# EAGLE design VentMonSwitches (EAGLE 9.6.2)
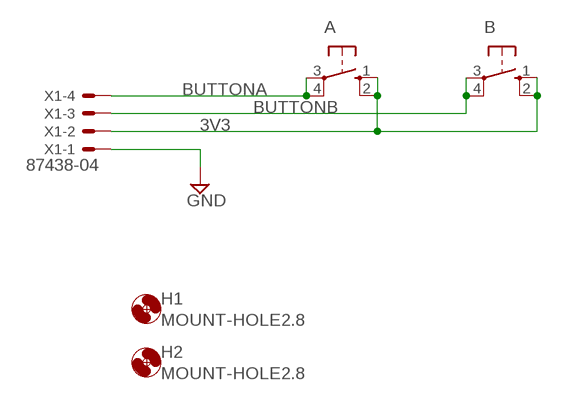
[diagram p0: schematic, sheet 1]

## Parts
A  10-XX  [B3F-10XX]
B  10-XX  [B3F-10XX]
H1  MOUNT-HOLE2.8  [2,8]
H2  MOUNT-HOLE2.8  [2,8]
X1  87438-04  [87438-04]

## Nets
3V3: A.1(S) A.2(S1) B.1(S) B.2(S1) X1.2
BUTTONA: A.3(P) A.4(P1) X1.4
BUTTONB: B.3(P) B.4(P1) X1.3
GND: X1.1

## Library data of the parts
A B = switch-omron:10-XX: OMRON SWITCH; MPN: B3F-1000; OC_FARNELL: 176432; OC_NEWARK: 36M3542
H1 H2 = holes:MOUNT-HOLE: MOUNTING HOLE with drill center marker
X1 = con-molex:87438-04: Wire-to-Board 1.50mm (.059") Pitch Header - Right Angle, SMT, Shrouded Source: http://www.molex.com/product/micro/87438.html; MF: MOLEX; OC_FARNELL: unknown; OC_NEWARK: unknown

## Board
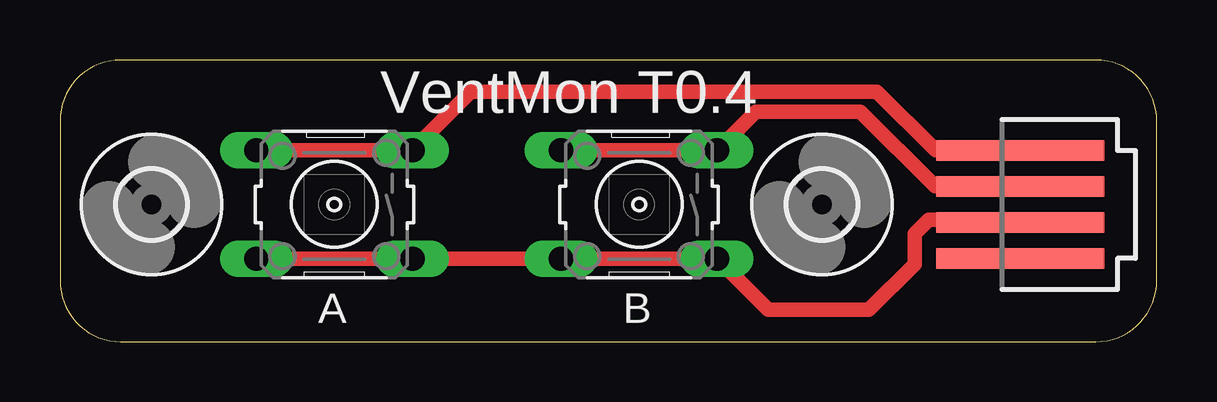
[diagram p1: board, top side]

Size 45.7 x 11.73 mm. Coordinates in mm from the lower left corner, seen from the top.
Outline: 43.16,11.73 2.54,11.73 arc90 0,9.2 0,2.54 arc90 2.54,0 43.16,0 arc90 45.7,2.54 45.7,9.2 arc90 43.16,11.73
Copper layers (1*16): Top 0.035mm / dielectric 1.5mm / Bottom 0.035mm
Design rules "default": minimum track width 6mil, minimum drill 0.35mm, track to track 6mil, track to pad 6mil, pad to pad 6mil, via to via 6mil, smd to smd 6mil, copper to edge 40mil, drill to drill 6mil, minimum pad ring 10mil, minimum via ring 8mil, stop-mask expansion 4mil, vias tented up to drill 0mil, thermal gap 10mil

### Footprints (pad centres in the part's own frame; a part is rotated, then mirrored left to right if it is on the bottom)
B3F-10XX = drill 1.016 long: 1 -3.251,2.261; 2 3.251,2.261; 3 -3.251,-2.261; 4 3.251,-2.261
2,8 = hole 2.8: 0,0
87438-04 = smd 7 x 0.85: 1 0,2.25; 2 0,0.75; 3 0,-0.75; 4 0,-2.25

### Placement (x,y rotation side)
A  11.43,5.71 180 top
B  24.13,5.71 180 top
H1  3.81,5.71 0 top
H2  31.75,5.71 0 top
X1  40.01,5.71 180 top

### Tracks (layer width: path | path; a pad name or v marks a point on that pad's centre or on a via)
3V3
  Top 0.61: X1.2 39.89,5.08 36.2,5.08 35.61,4.5 35.61,3.23 33.71,1.32 29.52,1.32 B.1 B.2 A.1 A.2
BUTTONA
  Top 0.61: A.4 A.3 17.12,10.41 34.04,10.41 36.48,7.96 X1.4
BUTTONB
  Top 0.61: X1.3 36.46,6.46 33.35,9.58 28.98,9.58 B.3 B.4

### Text on the board
tNames: VentMon T0.4